# Altium schematic sheet Sheet2.SchDoc
size A4
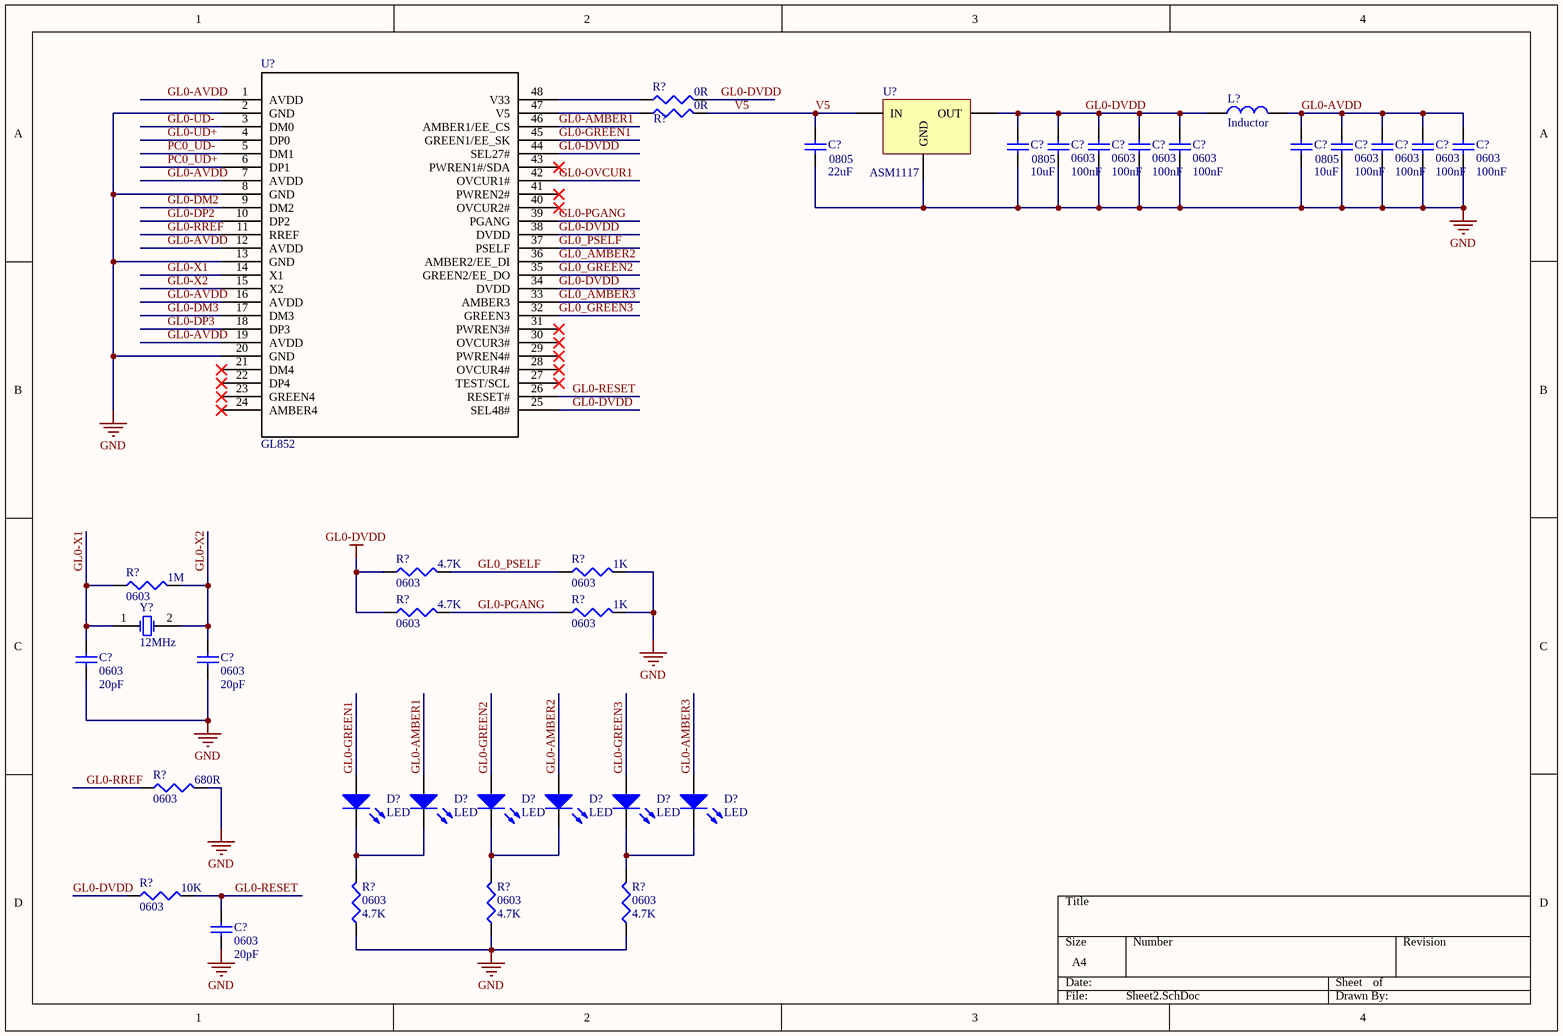
[diagram p0: Sheet2.SchDoc]

## Parts
(Parts that share a designator on the sheet are numbered #1, #2 ... from top to bottom, then left to right.)
C?#1  0805  value 22uF  [C1206]
C?#2  0805  value 10uF  [C1206]
C?#3  0603  value 100nF  [1608[0603]]
C?#4  0603  value 100nF  [1608[0603]]
C?#5  0603  value 100nF  [1608[0603]]
C?#6  0603  value 100nF  [1608[0603]]
C?#7  0805  value 10uF  [C1206]
C?#8  0603  value 100nF  [1608[0603]]
C?#9  0603  value 100nF  [1608[0603]]
C?#10  0603  value 100nF  [1608[0603]]
C?#11  0603  value 100nF  [1608[0603]]
C?#12  0603  value 20pF  [1608[0603]]
C?#13  0603  value 20pF  [1608[0603]]
C?#14  0603  value 20pF  [1608[0603]]
D?#1  LED  [F5mm]
D?#2  LED  [F5mm]
D?#3  LED  [F5mm]
D?#4  LED  [F5mm]
D?#5  LED  [F5mm]
D?#6  LED  [F5mm]
L?  Inductor  [CD127]
R?#1  value 0R  [J1-0603]  (hidden comment: 0603)
R?#2  value 0R  [J1-0603]  (hidden comment: 0603)
R?#3  0603  value 4.7K  [J1-0603]
R?#4  0603  value 1K  [J1-0603]
R?#5  0603  value 1M  [J1-0603]
R?#6  0603  value 4.7K  [J1-0603]
R?#7  0603  value 1K  [J1-0603]
R?#8  0603  value 680R  [J1-0603]
R?#9  0603  value 10K  [J1-0603]
R?#10  0603  value 4.7K  [J1-0603]
R?#11  0603  value 4.7K  [J1-0603]
R?#12  0603  value 4.7K  [J1-0603]
U?#1  GL852  [qfp48-20-0909b]
U?#2  ASM1117  [SOT-223]
Y?  12MHz  [R38]

## Nets
GL0-DVDD: C?#2.2 C?#3.2 C?#4.2 C?#5.2 C?#6.2 L?.1 R?#1.2 R?#3.1 R?#6.1 R?#9.1 U?#1.25(SEL48#) U?#1.34(DVDD) U?#1.38(DVDD) U?#1.44(SEL27#) U?#2.2(OUT)
GND: C?#1.1 C?#2.1 C?#3.1 C?#4.1 C?#5.1 C?#6.1 C?#7.1 C?#8.1 C?#9.1 C?#10.1 C?#11.1 C?#12.1 C?#13.1 C?#14.1 R?#4.2 R?#7.2 R?#8.2 R?#10.1 R?#11.1 R?#12.1 U?#1.2(GND) U?#1.8(GND) U?#1.13(GND) U?#1.20(GND) U?#2.1(GND)
GL0-AMBER1: D?#2.1(A) U?#1.46(AMBER1/EE_CS)
GL0-AMBER2: D?#4.1(A)
GL0-AMBER3: D?#6.1(A)
GL0-AVDD: C?#7.2 C?#8.2 C?#9.2 C?#10.2 C?#11.2 L?.2 U?#1.1(AVDD) U?#1.7(AVDD) U?#1.12(AVDD) U?#1.16(AVDD) U?#1.19(AVDD)
GL0-DM2: U?#1.9(DM2)
GL0-DM3: U?#1.17(DM3)
GL0-DP2: U?#1.10(DP2)
GL0-DP3: U?#1.18(DP3)
GL0-GREEN1: D?#1.1(A) U?#1.45(GREEN1/EE_SK)
GL0-GREEN2: D?#3.1(A)
GL0-GREEN3: D?#5.1(A)
GL0-OVCUR1: U?#1.42(OVCUR1#)
GL0-PGANG: R?#6.2 R?#7.1 U?#1.39(PGANG)
GL0-RESET: C?#14.2 R?#9.2 U?#1.26(RESET#)
GL0-RREF: R?#8.1 U?#1.11(RREF)
GL0-UD+: U?#1.4(DP0)
GL0-UD-: U?#1.3(DM0)
GL0-X1: C?#12.2 R?#5.1 U?#1.14(X1) Y?.1(OSC1)
GL0-X2: C?#13.2 R?#5.2 U?#1.15(X2) Y?.2(OSC2)
GL0_AMBER2: U?#1.36(AMBER2/EE_DI)
GL0_AMBER3: U?#1.33(AMBER3)
GL0_GREEN2: U?#1.35(GREEN2/EE_DO)
GL0_GREEN3: U?#1.32(GREEN3)
GL0_PSELF: R?#3.2 R?#4.1 U?#1.37(PSELF)
PC0_UD+: U?#1.6(DP1)
PC0_UD-: U?#1.5(DM1)
V5: C?#1.2 R?#2.2 U?#2.3(IN)
NetD?#1_2: D?#1.2(K) D?#2.2(K) R?#10.2
NetD?#3_2: D?#3.2(K) D?#4.2(K) R?#11.2
NetD?#5_2: D?#5.2(K) D?#6.2(K) R?#12.2
NetR?#1_1: R?#1.1 U?#1.48(V33)
NetR?#2_1: R?#2.1 U?#1.47(V5)

Not connected (* = marked no-connect by the designer): U?#1 21(DM4)* 22(DP4)* 23(GREEN4)* 24(AMBER4)* 27(TEST/SCL)* 28(OVCUR4#)* 29(PWREN4#)* 30(OVCUR3#)* 31(PWREN3#)* 40(OVCUR2#)* 41(PWREN2#)* 43(PWREN1#/SDA)*

## Library data of the parts
C?#1-C?#14 = Cap Semi: Capacitor (Semiconductor SIM Model); Published: 8-Jun-2000; LatestRevisionDate: 29-May-2009; LatestRevisionNote: IPC-7351 Footprint Added.; PackageReference: C1206; Publisher: Altium Limited; PackageDescription: Chip Capacitor
R?#1-R?#12 = Res3: Resistor; Published: 8-Jun-2000; LatestRevisionDate: 29-May-2009; LatestRevisionNote: IPC-7351 Footprint Added.; PackageReference: J1-0603; Publisher: Altium Limited; PackageDescription: Chip Resistor
U?#1 = GL852: Imported; Devide: GL852; RefDes: RefDes; Type: DEV; Value: Value
Y? = XTAL: Crystal Oscillator; Published: 8-Jun-2000; LatestRevisionDate: 17-Jul-2002; LatestRevisionNote: Re-released for DXP Platform.; PackageReference: R38; Publisher: Altium Limited; PackageDescription: Crystal, Thru-Hole; 2 Leads; Body 3.1 x 8.2 mm (Dia.xH)